# EAGLE design main (EAGLE 5.01)
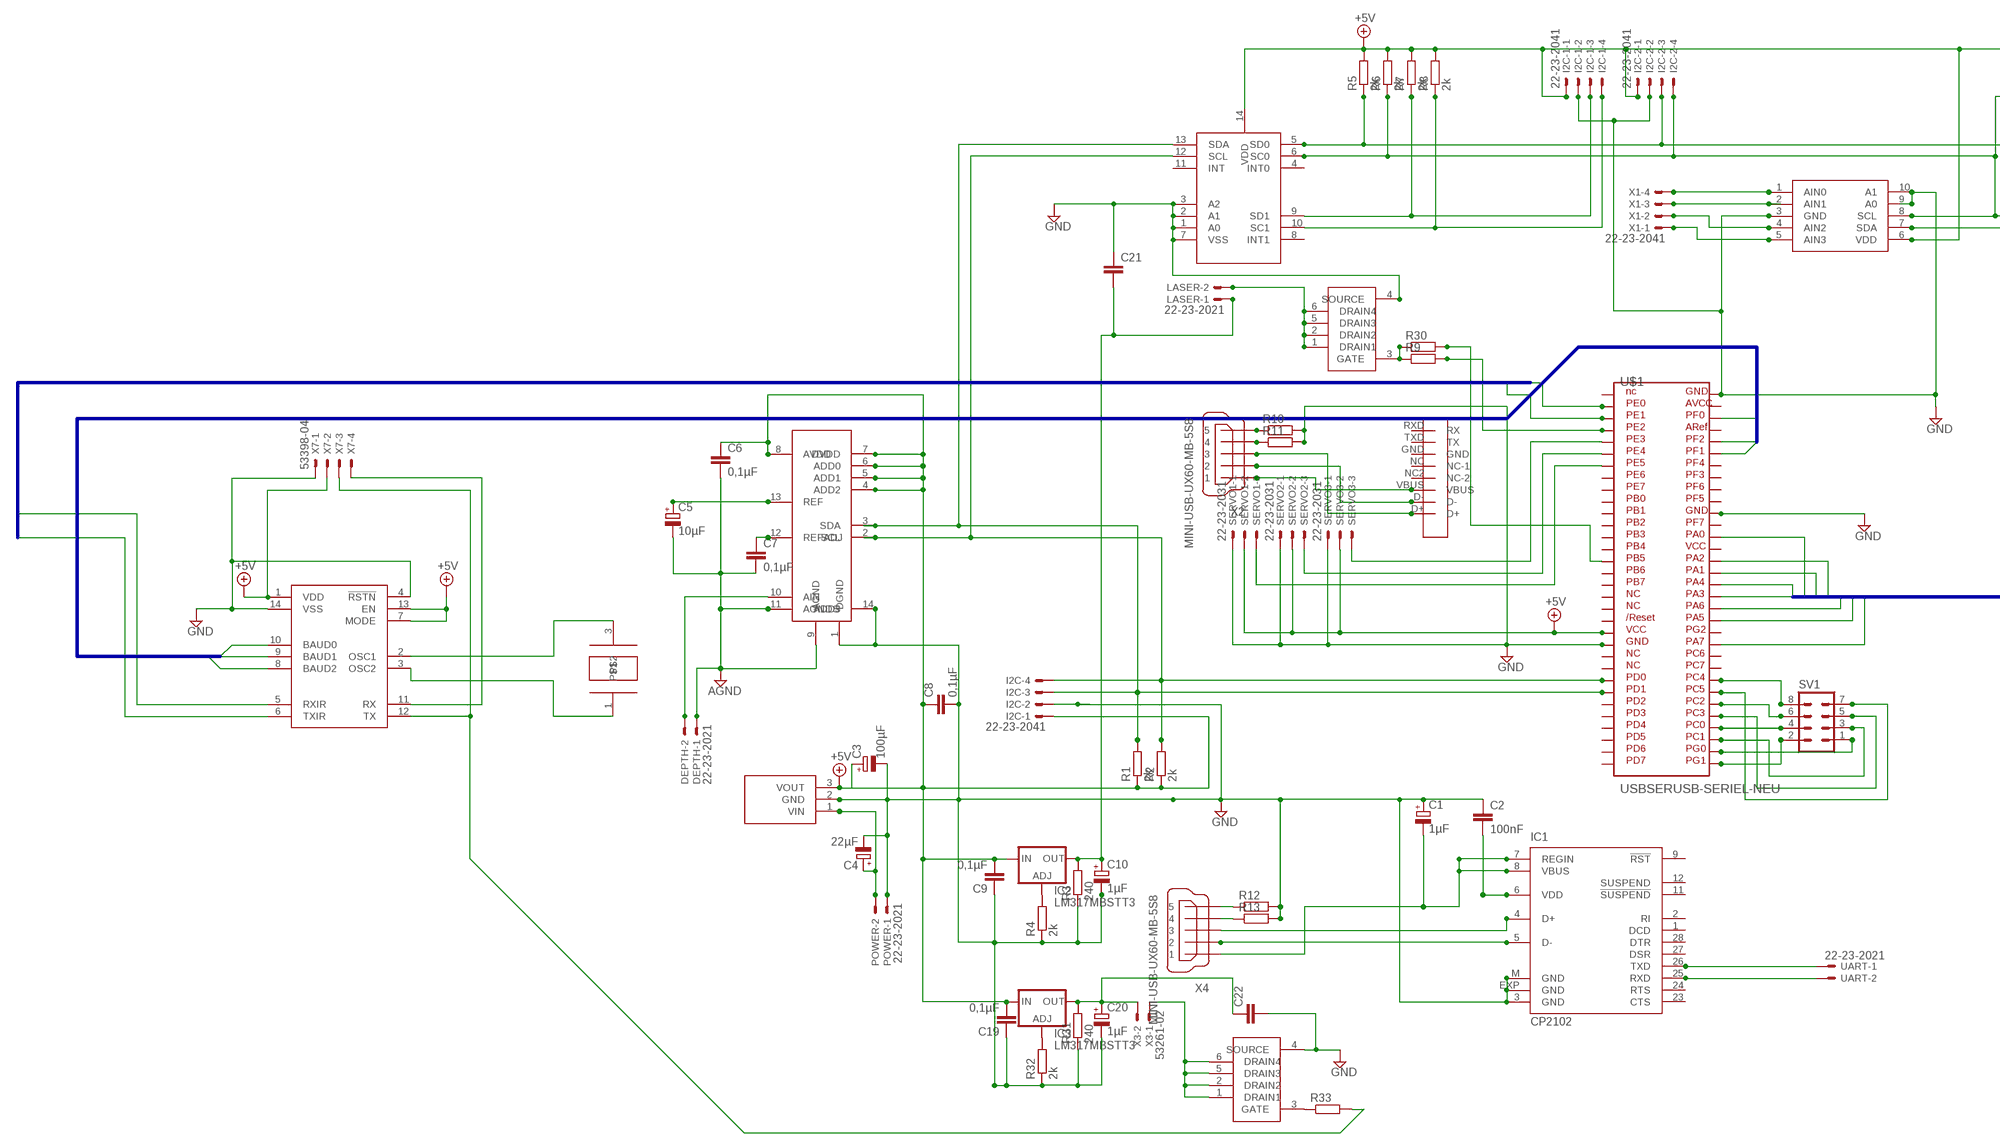
[diagram p0: schematic, sheet 1, part 1 of 2]
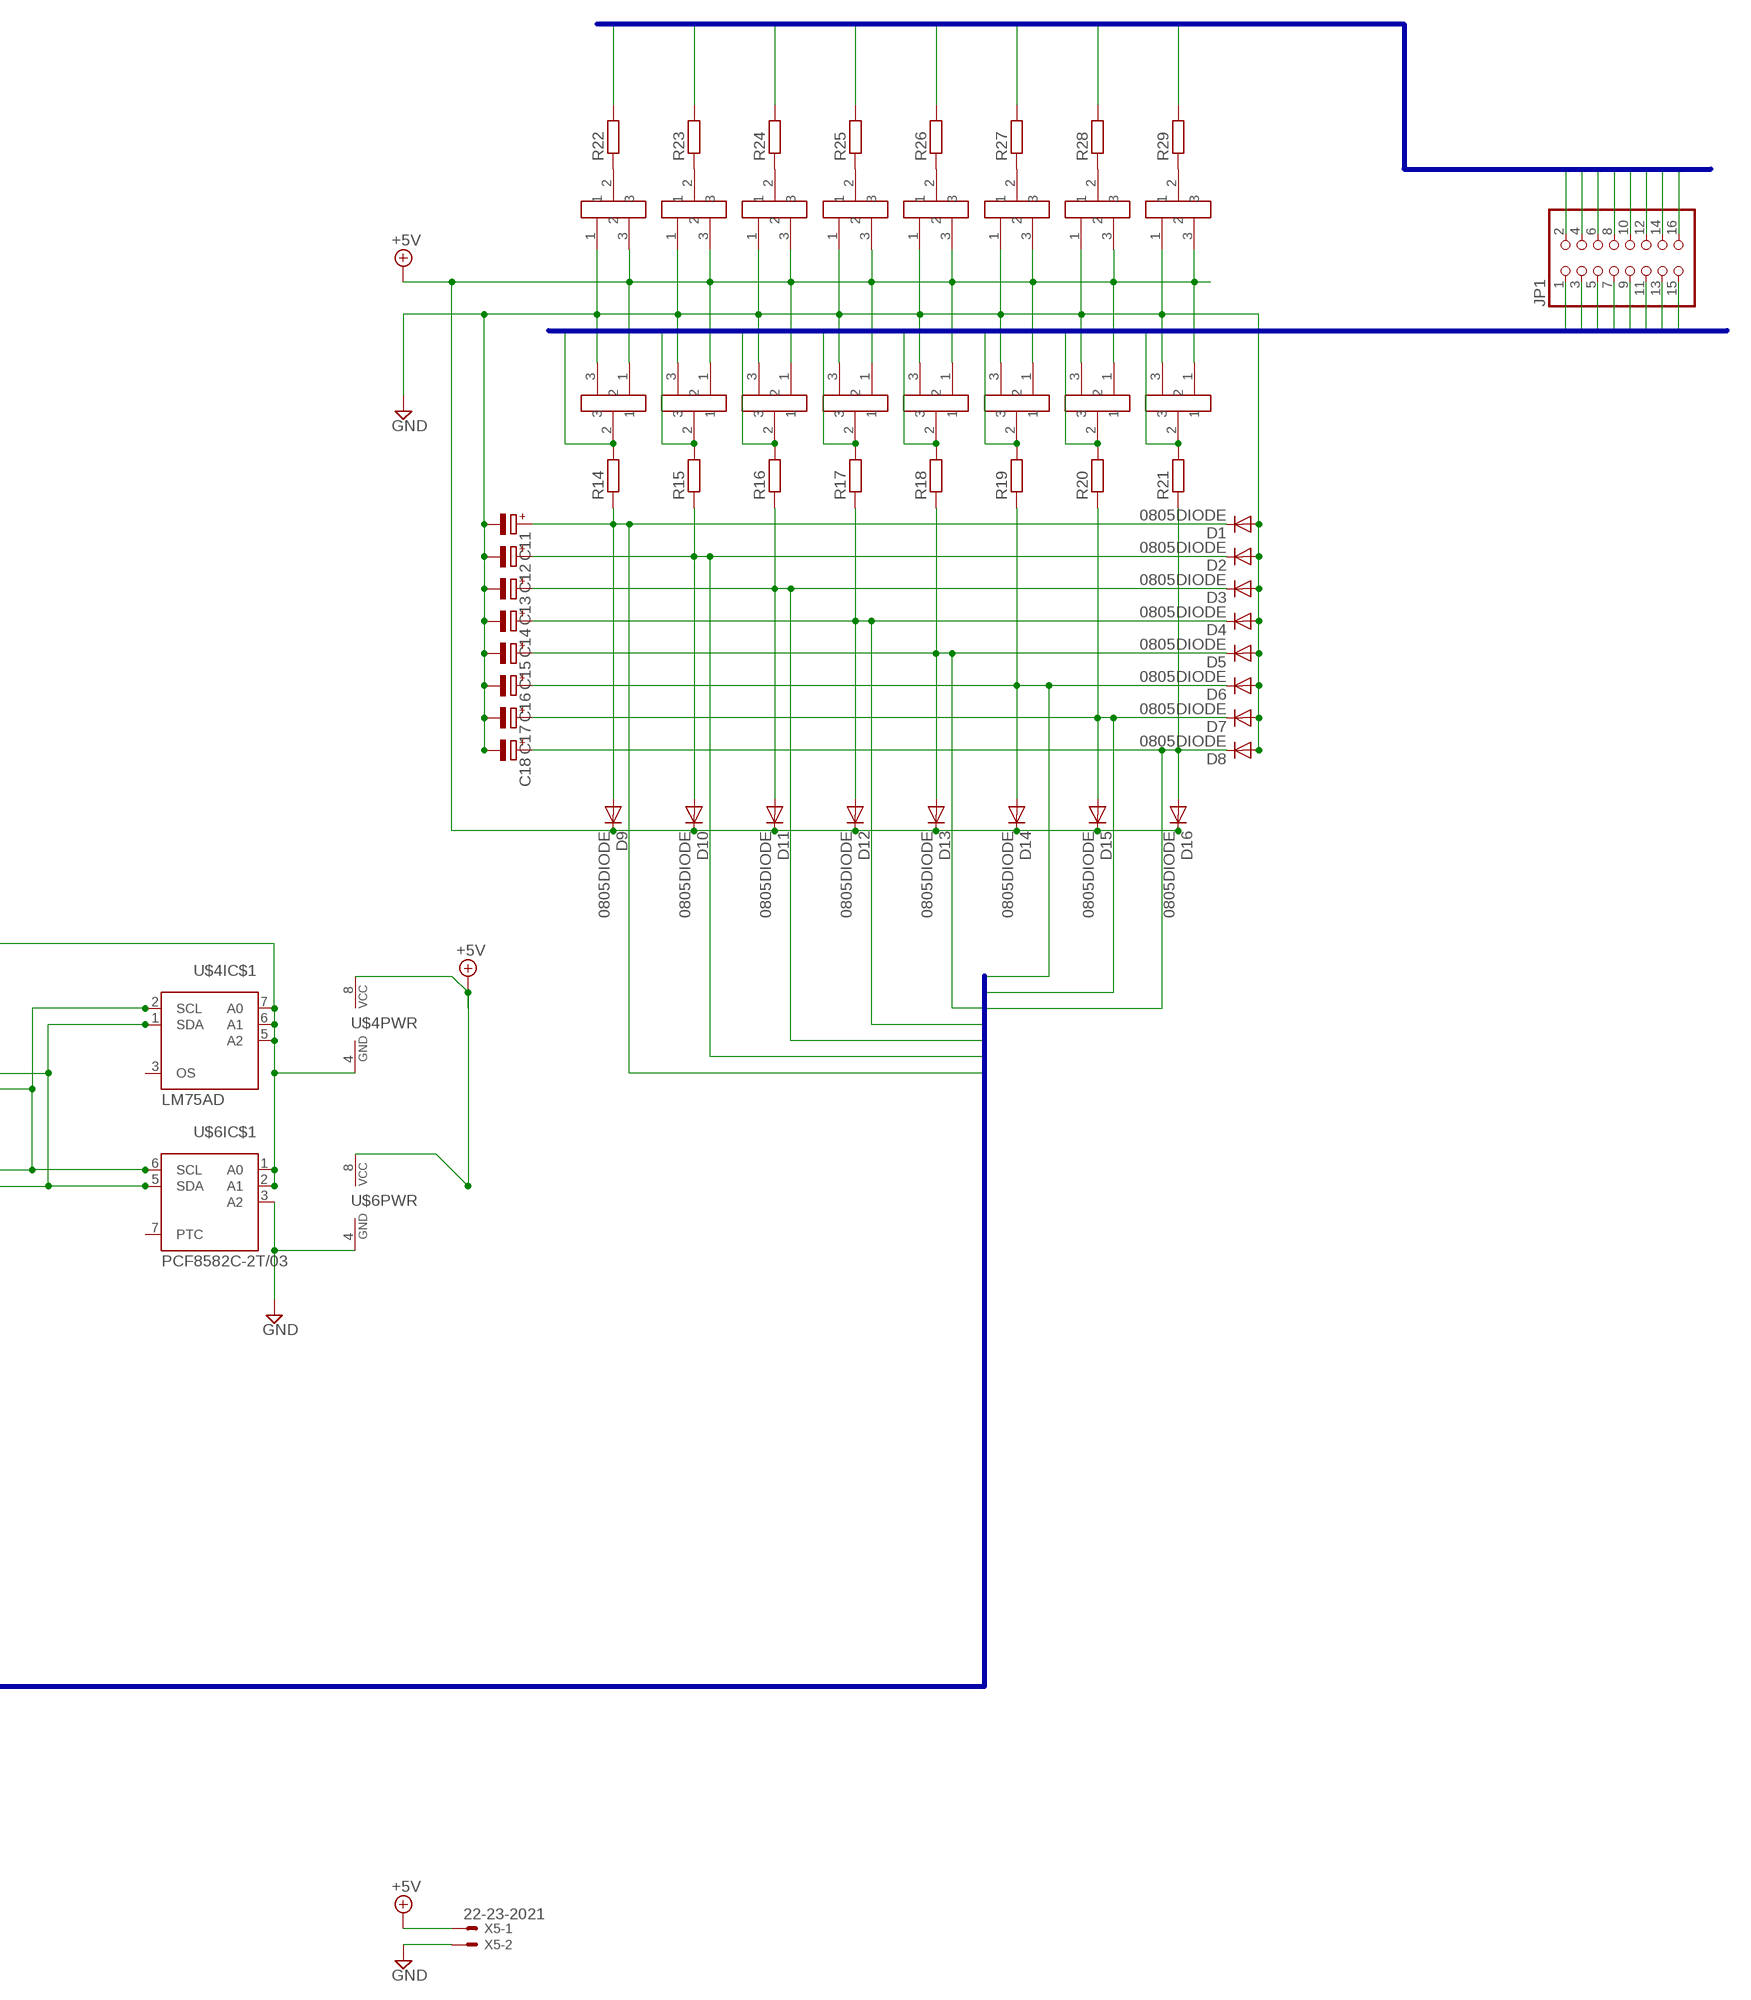
[diagram p1: schematic, sheet 1, part 2 of 2]

## Parts
C1  1µF  CPOL-EUE2.5-5  [E2,5-5]
C2  100nF  C-EUC0603  [C0603]
C3  100µF  CPOL-EUE2.5-5  [E2,5-5]
C4  22µF  CPOL-EUE2.5-5  [E2,5-5]
C5  10µF  CPOL-EUE2.5-7  [E2,5-7]
C6  0,1µF  C-EUC0603  [C0603]
C7  0,1µF  C-EUC0603  [C0603]
C8  0,1µF  C-EUC0603  [C0603]
C9  0,1µF  C-EUC0603  [C0603]
C10  1µF  CPOL-EUE2.5-5  [E2,5-5]
C11  CPOL-EUE2.5-5  [E2,5-5]
C12  CPOL-EUE2.5-5  [E2,5-5]
C13  CPOL-EUE2.5-5  [E2,5-5]
C14  CPOL-EUE2.5-5  [E2,5-5]
C15  CPOL-EUE2.5-5  [E2,5-5]
C16  CPOL-EUE2.5-5  [E2,5-5]
C17  CPOL-EUE2.5-5  [E2,5-5]
C18  CPOL-EUE2.5-5  [E2,5-5]
C19  0,1µF  C-EUC0603  [C0603]
C20  1µF  CPOL-EUE2.5-5  [E2,5-5]
C21  C-EUC1206  [C1206]
C22  C-EUC1206  [C1206]
D1  0805DIODE  [R0805]
D2  0805DIODE  [R0805]
D3  0805DIODE  [R0805]
D4  0805DIODE  [R0805]
D5  0805DIODE  [R0805]
D6  0805DIODE  [R0805]
D7  0805DIODE  [R0805]
D8  0805DIODE  [R0805]
D9  0805DIODE  [R0805]
D10  0805DIODE  [R0805]
D11  0805DIODE  [R0805]
D12  0805DIODE  [R0805]
D13  0805DIODE  [R0805]
D14  0805DIODE  [R0805]
D15  0805DIODE  [R0805]
D16  0805DIODE  [R0805]
DEPTH  22-23-2021  [22-23-2021]
I2C  22-23-2041  [22-23-2041]
I2C-1  22-23-2041  [22-23-2041]
I2C-2  22-23-2041  [22-23-2041]
IC1  CP2102  [MLP28]
IC2  LM317MBSTT3  [SOT223]
IC3  LM317MBSTT3  [SOT223]
JP1  PINHD-2X8  [2X08]
LASER  22-23-2021  [22-23-2021]
MCP2120  MCP2120  [SOIC14]
POWER  22-23-2021  [22-23-2021]
R1  2k  R-EU_R0603  [R0603]
R2  2k  R-EU_R0603  [R0603]
R3  240  R-EU_R0603  [R0603]
R4  2k  R-EU_R0603  [R0603]
R5  2k  R-EU_R0603  [R0603]
R6  2k  R-EU_R0603  [R0603]
R7  2k  R-EU_R0603  [R0603]
R8  2k  R-EU_R0603  [R0603]
R9  R-EU_R0603  [R0603]
R10  R-EU_R0603  [R0603]
R11  R-EU_R0603  [R0603]
R12  R-EU_R0603  [R0603]
R13  R-EU_R0603  [R0603]
R14  R-EU_R0603  [R0603]
R15  R-EU_R0603  [R0603]
R16  R-EU_R0603  [R0603]
R17  R-EU_R0603  [R0603]
R18  R-EU_R0603  [R0603]
R19  R-EU_R0603  [R0603]
R20  R-EU_R0603  [R0603]
R21  R-EU_R0603  [R0603]
R22  R-EU_R0603  [R0603]
R23  R-EU_R0603  [R0603]
R24  R-EU_R0603  [R0603]
R25  R-EU_R0603  [R0603]
R26  R-EU_R0603  [R0603]
R27  R-EU_R0603  [R0603]
R28  R-EU_R0603  [R0603]
R29  R-EU_R0603  [R0603]
R30  R-EU_R0603  [R0603]
R31  240  R-EU_R0603  [R0603]
R32  2k  R-EU_R0603  [R0603]
R33  R-EU_R0603  [R0603]
SERVO1  22-23-2031  [22-23-2031]
SERVO2  22-23-2031  [22-23-2031]
SERVO3  22-23-2031  [22-23-2031]
SV1  MA04-2  [MA04-2]
U$1  USBSERUSB-SERIEL-NEU  [SERIAL-USB-NEU]
U$2  R78BXX-1.0  [SIP3]
U$3  MAX1169  [TSSOP14]
U$4  LM75AD  [SO08]
U$5  PCA9542AD-T  [SOIC14]
U$6  PCF8582C-2T/03  [SO08]
U$7  ADS1112  [MSOP10]
U$8  NTGS4141N  [SSOT6]
U$9  SMD-CON-3-PIN  [SMDPAD-3X]
U$10  SMD-CON-3-PIN  [SMDPAD-3X]
U$11  SMD-CON-3-PIN  [SMDPAD-3X]
U$12  SMD-CON-3-PIN  [SMDPAD-3X]
U$13  SMD-CON-3-PIN  [SMDPAD-3X]
U$14  SMD-CON-3-PIN  [SMDPAD-3X]
U$15  SMD-CON-3-PIN  [SMDPAD-3X]
U$16  SMD-CON-3-PIN  [SMDPAD-3X]
U$17  SMD-CON-3-PIN  [SMDPAD-3X]
U$18  SMD-CON-3-PIN  [SMDPAD-3X]
U$19  SMD-CON-3-PIN  [SMDPAD-3X]
U$20  SMD-CON-3-PIN  [SMDPAD-3X]
U$21  SMD-CON-3-PIN  [SMDPAD-3X]
U$22  SMD-CON-3-PIN  [SMDPAD-3X]
U$23  SMD-CON-3-PIN  [SMDPAD-3X]
U$24  SMD-CON-3-PIN  [SMDPAD-3X]
U$25  ABMM2  [ABMM2]
U$27  NTGS4141N  [SSOT6]
UART  22-23-2021  [22-23-2021]
X1  22-23-2041  [22-23-2041]
X2  MINI-USB-UX60-MB-5S8  [UX60-MB-5S8]
X3  53261-02  [53261-02]
X4  MINI-USB-UX60-MB-5S8  [UX60-MB-5S8]
X5  22-23-2021  [22-23-2021]
X7  53398-04  [53398-04]

## Nets
+3V: C10.+ C21.2 IC2.4(OUT) LASER.1 R3.2
+5V: C3.+ C6.1 C8.1 C9.2 C19.2 D9.2(C) D10.2(C) D11.2(C) D12.2(C) D13.2(C) D14.2(C) D15.2(C) D16.2(C) I2C-1.1 I2C-2.1 I2C.1 IC2.3(IN) IC3.3(IN) MCP2120.1(VDD) MCP2120.7(MODE) MCP2120.13(EN) R1.1 R2.1 R5.2 R6.2 R7.2 R8.2 SERVO1.2 SERVO2.2 SERVO3.2 U$1.VCC2(VCC) U$2.3(VOUT) U$3.4(ADD2) U$3.5(ADD1) U$3.6(ADD0) U$3.7(DVDD) U$3.8(AVDD) U$4.4(PWR:GND) U$4.5(IC$1:A2) U$4.6(IC$1:A1) U$4.7(IC$1:A0) U$4.8(PWR:VCC) U$5.14(VDD) U$6.1(IC$1:A0) U$6.2(IC$1:A1) U$6.8(PWR:VCC) U$7.6(VDD) U$9.1 U$10.1 U$11.1 U$12.1 U$13.1 U$14.1 U$15.1 U$16.1 U$17.3 U$18.3 U$19.3 U$20.3 U$21.3 U$22.3 U$23.3 U$24.3 X5.1 X7.2
ADD0: JP1.1 R14.2 U$9.2
ADD1: JP1.3 R15.2 U$10.2
ADD2: JP1.5 R16.2 U$11.2
ADD3: JP1.7 R17.2 U$12.2
ADD4: JP1.9 R18.2 U$13.2
ADD5: JP1.11 R19.2 U$14.2
ADD6: JP1.13 R20.2 U$15.2
ADD7: JP1.15 R21.2 U$16.2
ADG0: JP1.2 R22.2
ADG1: JP1.4 R23.2
ADG2: JP1.6 R24.2
ADG3: JP1.8 R25.2
ADG4: JP1.10 R26.2
ADG5: JP1.12 R27.2
ADG6: JP1.14 R28.2
ADG7: JP1.16 R29.2
AGND: C5.- C6.2 C7.2 DEPTH.1 U$3.9(AGND) U$3.11(AGNDS)
GND: C1.+ C2.1 C3.- C4.- C8.2 C9.1 C10.- C11.- C12.- C13.- C14.- C15.- C16.- C17.- C18.- C19.1 C20.- C21.1 C22.2 D1.1(A) D2.1(A) D3.1(A) D4.1(A) D5.1(A) D6.1(A) D7.1(A) D8.1(A) I2C-1.2 I2C-2.2 I2C.2 IC1.3(GND) IC1.EXP(GND) IC1.M(GND) MCP2120.4(!RSTN) MCP2120.14(VSS) POWER.1 R3.1 R4.1 R10.2 R11.2 R12.2 R13.2 R31.1 R32.1 SERVO1.1 SERVO2.1 SERVO3.1 U$1.GND2(GND) U$1.GND3(GND) U$1.GND4(GND) U$2.2(GND) U$3.1(DGND) U$3.14(ADD3) U$5.1(A0) U$5.2(A1) U$5.3(A2) U$5.7(VSS) U$6.3(IC$1:A2) U$6.4(PWR:GND) U$7.3(GND) U$7.9(A0) U$7.10(A1) U$8.4(SOURCE) U$9.3 U$10.3 U$11.3 U$12.3 U$13.3 U$14.3 U$15.3 U$16.3 U$17.1 U$18.1 U$19.1 U$20.1 U$21.1 U$22.1 U$23.1 U$24.1 U$27.4(SOURCE) X5.2 X7.1
N$1: IC1.26(TXD) UART.1
N$2: IC1.25(RXD) UART.2
N$3: R13.1 X4.4
N$4: IC1.5(D-) X4.2
N$5: C1.- IC1.7(REGIN) IC1.8(VBUS) X4.1
N$6: C2.2 IC1.6(VDD)
N$7: I2C.4 R2.2 U$1.PD0 U$3.2(SCL) U$5.12(SCL)
N$8: C5.+ U$3.13(REF)
N$9: C7.1 U$3.12(REFADJ)
N$10: R9.1 R30.1 U$8.3(GATE)
N$11: DEPTH.2 U$3.10(AIN)
N$12: I2C.3 R1.2 U$1.PD1 U$3.3(SDA) U$5.13(SDA)
N$15: IC2.1(ADJ) R4.2
N$16: R30.2 U$1.PB5
N$17: SV1.1 U$1.PG0
N$18: I2C-2.3 R5.1 U$4.1(IC$1:SDA) U$5.5(SD0) U$6.5(IC$1:SDA) U$7.7(SDA)
N$19: I2C-2.4 R6.1 U$4.2(IC$1:SCL) U$5.6(SC0) U$6.6(IC$1:SCL) U$7.8(SCL)
N$20: R12.1 X4.5
N$21: I2C-1.3 R7.1 U$5.9(SD1)
N$22: I2C-1.4 R8.1 U$5.10(SC1)
N$23: C4.+ POWER.2 U$2.1(VIN)
N$24: U$7.1(AIN0) X1.4
N$25: U$7.2(AIN1) X1.3
N$26: U$7.4(AIN2) X1.2
N$27: U$7.5(AIN3) X1.1
N$28: R9.2 U$1.PE2
N$29: U$1.D- X2.2
N$30: LASER.2 U$8.1(DRAIN1) U$8.2(DRAIN2) U$8.5(DRAIN3) U$8.6(DRAIN4)
N$31: U$1.D+ X2.3
N$32: U$1.VBUS X2.1
N$33: IC1.4(D+) X4.3
N$34: SERVO3.3 U$1.PE3
N$35: R10.1 X2.5
N$36: R11.1 X2.4
N$37: SERVO2.3 U$1.PE4
N$38: SERVO1.3 U$1.PE5
N$39: SV1.2 U$1.PG1
N$40: SV1.3 U$1.PC1
N$41: SV1.4 U$1.PC0
N$42: SV1.5 U$1.PC3
N$43: SV1.6 U$1.PC2
N$44: R22.1 U$17.2
N$45: R23.1 U$18.2
N$46: R24.1 U$19.2
N$47: R25.1 U$20.2
N$48: R26.1 U$21.2
N$49: R27.1 U$22.2
N$50: R28.1 U$23.2
N$51: R29.1 U$24.2
N$52: SV1.7 U$1.PC5
N$53: SV1.8 U$1.PC4
N$54: R33.1 U$27.3(GATE)
N$55: C20.+ C22.1 IC3.4(OUT) R31.2 X3.2
N$56: IC3.1(ADJ) R32.2
N$57: U$27.1(DRAIN1) U$27.2(DRAIN2) U$27.5(DRAIN3) U$27.6(DRAIN4) X3.1
N$61: MCP2120.3(OSC2) U$25.1
N$62: MCP2120.2(OSC1) U$25.3
PA0: C11.+ D1.2(C) D9.1(A) R14.1 U$1.PA0
PA1: C12.+ D2.2(C) D10.1(A) R15.1 U$1.PA1
PA2: C13.+ D3.2(C) D11.1(A) R16.1 U$1.PA2
PA3: C14.+ D4.2(C) D12.1(A) R17.1 U$1.PA3
PA4: C15.+ D5.2(C) D13.1(A) R18.1 U$1.PA4
PA5: C16.+ D6.2(C) D14.1(A) R19.1 U$1.PA5
PA6: C17.+ D7.2(C) D15.1(A) R20.1 U$1.PA6
PA7: C18.+ D8.2(C) D16.1(A) R21.1 U$1.PA7
PF0: MCP2120.10(BAUD0) U$1.PF0
PF1: MCP2120.9(BAUD1) U$1.PF1
PF2: MCP2120.8(BAUD2) U$1.PF2
RXIR: MCP2120.11(RX) X7.4
TXIR: MCP2120.12(TX) R33.2 X7.3
UART0: MCP2120.5(RXIR) U$1.PE0
UART1: MCP2120.6(TXIR) U$1.PE1
Unconnected: IC1.1(DCD) IC1.2(RI) IC1.9(!RST) IC1.11(!SUSPEND) IC1.12(SUSPEND) IC1.23(CTS) IC1.24(RTS) IC1.27(DSR) IC1.28(DTR) U$1.AREF U$1.AVCC U$1.CANH(NC) U$1.CANL(NC) U$1.GND U$1.NC2(NC-2) U$1.NC3(NC) U$1.NC4(NC) U$1.NC(NC-1) U$1.PB0 U$1.PB1 U$1.PB2 U$1.PB3 U$1.PB4 U$1.PB6 U$1.PB7 U$1.PC6 U$1.PC7 U$1.PD2 U$1.PD3 U$1.PD4 U$1.PD5 U$1.PD6 U$1.PD7 U$1.PE6 U$1.PE7 U$1.PF3 U$1.PF4 U$1.PF5 U$1.PF6 U$1.PF7 U$1.PG2 U$1.RESET(NC) U$1.RS(/RESET) U$1.RXD(RX) U$1.TXD(TX) U$1.VCC U$4.3(IC$1:OS) U$5.4(INT0) U$5.8(INT1) U$5.11(INT) U$6.7(IC$1:PTC)

## Buses
PA[0..7]
ADD[0..7]
ADG[0..7]
UART[0..1]
PF[0..2]

## Library data of the parts
C1 C3-C5 C10-C18 C20 = rcl:CPOL-EU: POLARIZED CAPACITOR, European symbol
C2 C6-C9 C19 C21 C22 = rcl:C-EU: CAPACITOR, European symbol
D1-D16 = matthias:0805DIODE
DEPTH LASER POWER UART X5 = con-molex:22-23-2021: .100" (2.54mm) Center Header - 2 Pin
I2C I2C-1 I2C-2 X1 = con-molex:22-23-2041: .100" (2.54mm) Center Header - 4 Pin
IC1 = silabs:CP210*: Single-Chip USB to UART Bridge Source: www.silabs.com .. CP2101.pdf / cp2102.pdf
IC2 IC3 = v-reg:LM317?*: 500 mA Adjustable Output Positive Voltage Regulator Source: http://www.onsemi.co.jp .. LM317M-D.PDF
JP1 = pinhead:PINHD-2X8: PIN HEADER
MCP2120 = matthias:MCP2120
R1-R33 = rcl:R-EU_: RESISTOR, European symbol
SERVO1-SERVO3 = con-molex:22-23-2031: .100" (2.54mm) Center Header - 3 Pin
SV1 = con-lstb:MA04-2: PIN HEADER
U$1 = crumb128symbol:USBSER
U$2 = matthias:R78BXX-1.0
U$3 = maxim:MAX1169
U$4 = i2c:LM75AD: Digital Temperature Sensor and Thermal Watchdog
U$5 = matthias:PCA9542AD-T
U$6 = i2c:PCF8582C-2: 256 x 8-Bit CMOS EEPROM with I²C Bus Interface
U$7 = matthias:ADS1112
U$8 U$27 = matthias:NTGS4141N
U$9-U$24 = matthias:SMD-CON-3-PIN
U$25 = matthias:ABMM2
X2 X4 = con-hirose:MINI-USB-: MINI USB Connector Source: http://www.hirose.co.jp/cataloge_hp/e24000019.pdf
X3 = con-molex:53?-02: CONNECTOR wire to board 1.25 mm (.049 inch) pitch header
X7 = con-molex:53?-04: CONNECTOR wire to board 1.25 mm (.049 inch) pitch header

## Board
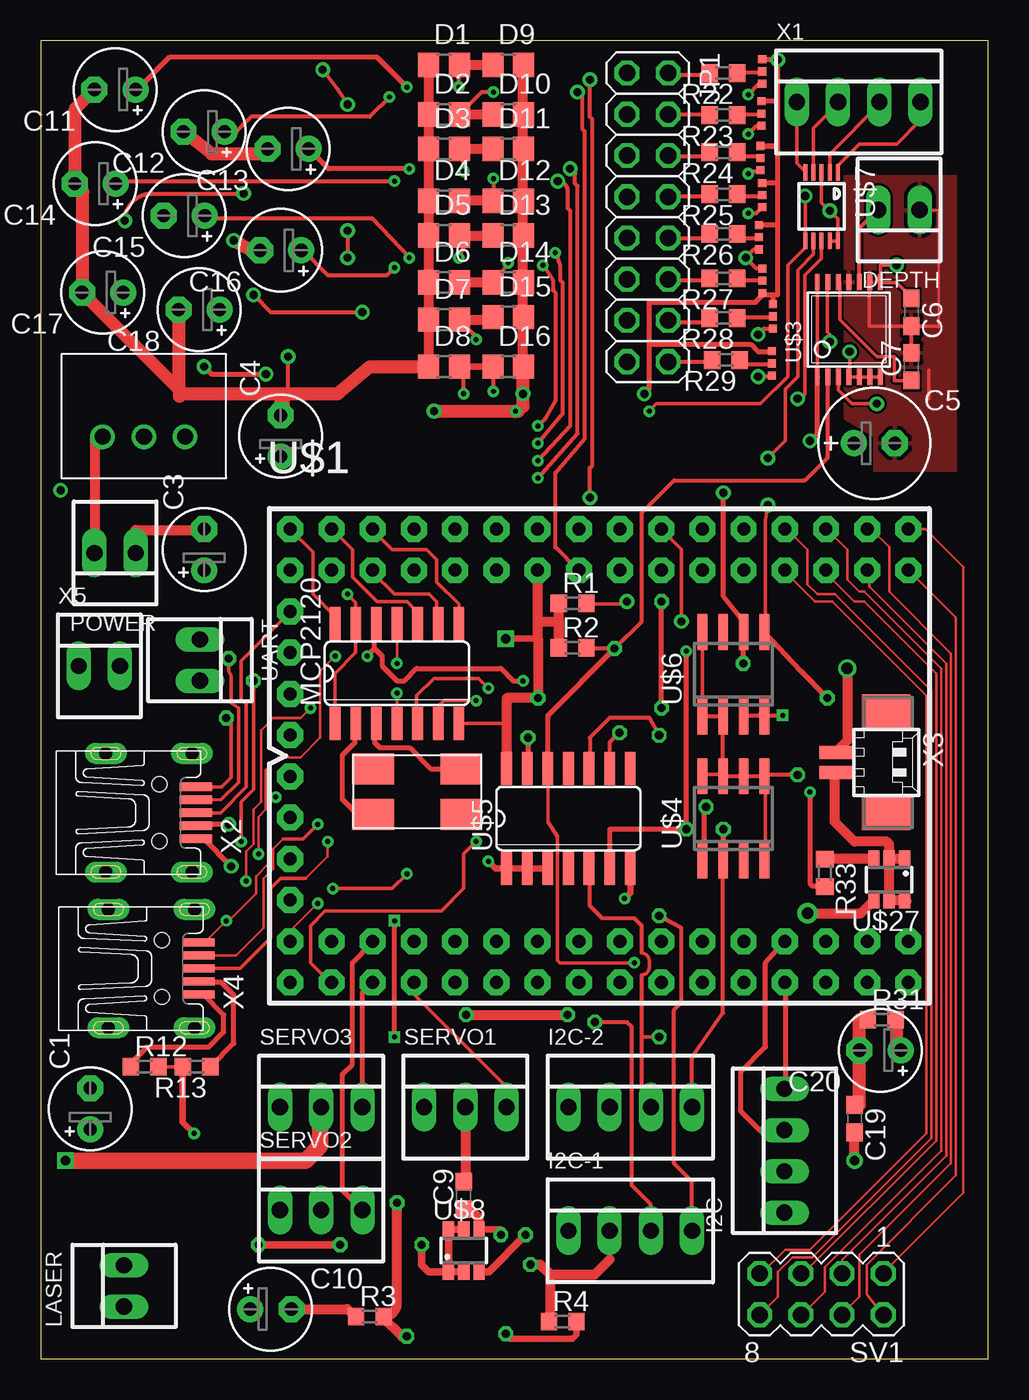
[diagram p2: board, top side]
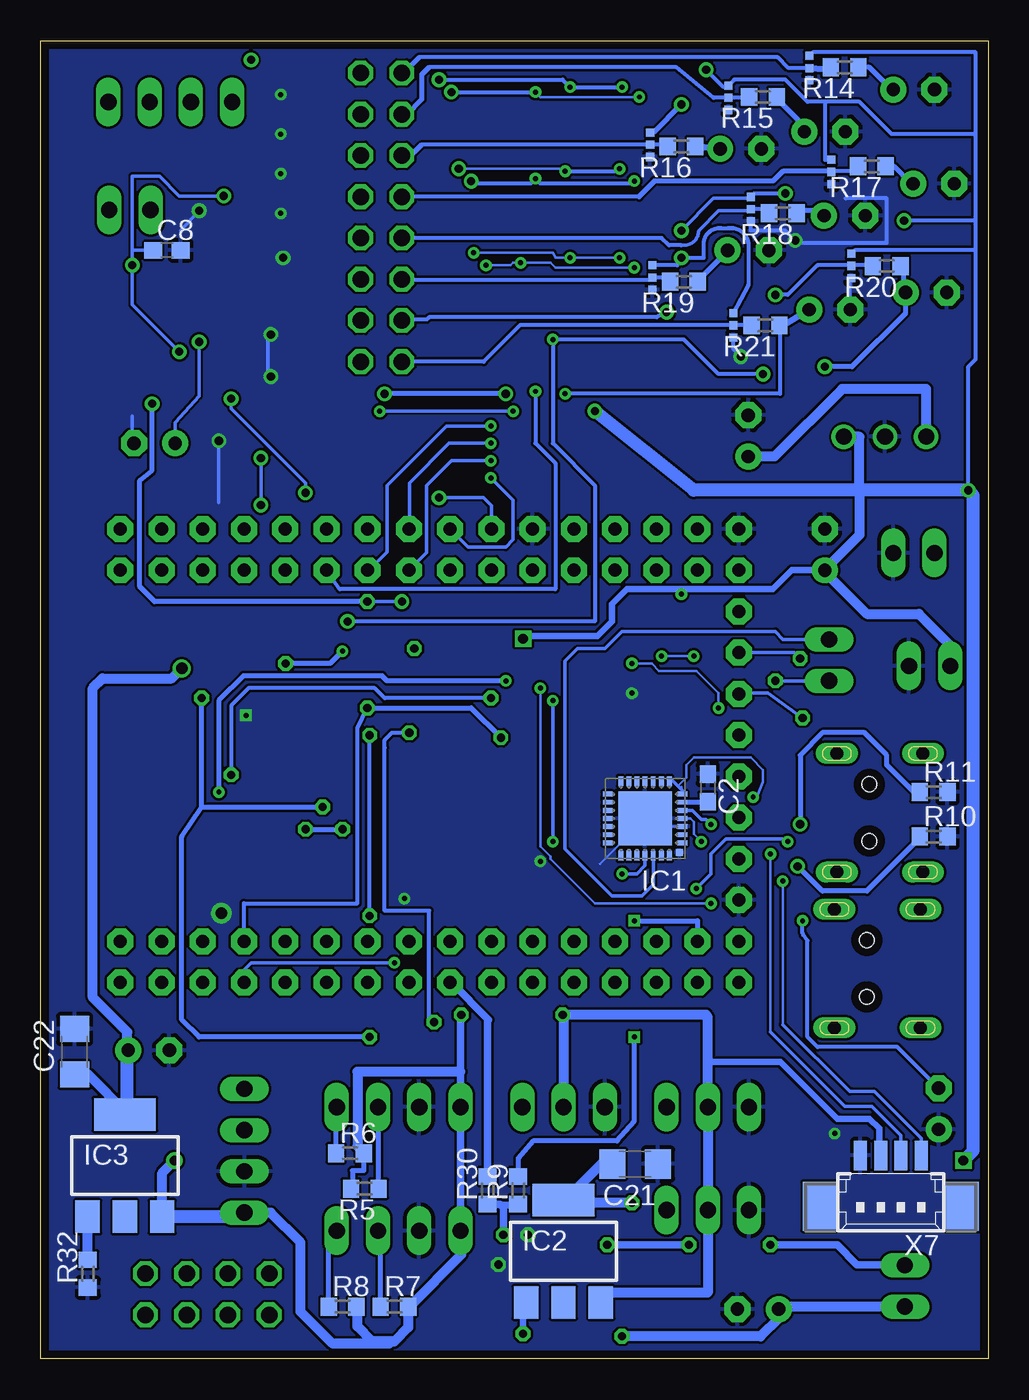
[diagram p3: board, bottom side, seen from below]

Size 58.39 x 81.22 mm. Coordinates in mm from the lower left corner, seen from the top.
Outline: 0,0 58.39,0 58.39,81.22 0,81.22 0,0
Copper layers (1*16): Top 0.035mm / dielectric 1.5mm / Bottom 0.035mm
Design rules "default *": minimum track width 6mil, minimum drill 12mil, track to track 6mil, track to pad 6mil, pad to pad 6mil, via to via 6mil, smd to smd 6mil, copper to edge 20mil, drill to drill 6mil, minimum pad ring 10mil, minimum via ring 8mil, stop-mask expansion 4mil, vias tented up to drill 20mil, thermal gap 10mil

### Footprints (pad centres in the part's own frame; a part is rotated, then mirrored left to right if it is on the bottom)
E2,5-5 = drill 0.813 pad 1.6 round: + -1.27,0 | drill 0.813 pad 1.6 octagon: - 1.27,0
C0603 = smd 1.1 x 1: 1 -0.85,0; 2 0.85,0
E2,5-7 = drill 0.813 pad 1.6 round: + -1.27,0 | drill 0.813 pad 1.6 octagon: - 1.27,0
C1206 = smd 1.6 x 1.8: 1 -1.4,0; 2 1.4,0
R0805 = smd 1.3 x 1.5: 1 -0.95,0; 2 0.95,0
22-23-2021 = drill 1 long: 1 -1.27,0; 2 1.27,0
22-23-2041 = drill 1 long: 1 -3.81,0; 2 -1.27,0; 3 1.27,0; 4 3.81,0
MLP28 = smd 0.6 x 0.3: 1 -2.3,1.5; 2 -2.3,1; 3 -2.3,0.5; 4 -2.3,0; 5 -2.3,-0.5; 6 -2.3,-1; 7 -2.3,-1.5; 15 2.3,-1.5; 16 2.3,-1; 17 2.3,-0.5; 18 2.3,0; 19 2.3,0.5; 20 2.3,1; 21 2.3,1.5 | smd 0.3 x 0.6: 8 -1.5,-2.3; 9 -1,-2.3; 10 -0.5,-2.3; 11 0,-2.3; 12 0.5,-2.3; 13 1,-2.3; 14 1.5,-2.3; 22 1.5,2.3; 23 1,2.3; 24 0.5,2.3; 25 0,2.3; 26 -0.5,2.3; 27 -1,2.3; 28 -1.5,2.3 | smd 3.3 x 3.3: EXP 0,0 | smd 0.435 x 0.435: M -2.103,2.103
SOT223 = smd 1.5 x 2: 1 -2.3,-3.15; 2 0,-3.15; 3 2.3,-3.15 | smd 3.8 x 2: 4 0,3.15
2X08 = drill 1.016 octagon: 1 -8.89,-1.27; 2 -8.89,1.27; 3 -6.35,-1.27; 4 -6.35,1.27; 5 -3.81,-1.27; 6 -3.81,1.27; 7 -1.27,-1.27; 8 -1.27,1.27; 9 1.27,-1.27; 10 1.27,1.27; 11 3.81,-1.27; 12 3.81,1.27; 13 6.35,-1.27; 14 6.35,1.27; 15 8.89,-1.27; 16 8.89,1.27
SOIC14 = smd 0.66 x 2.032: 1 -3.81,-3.073; 2 -2.54,-3.073; 3 -1.27,-3.073; 4 0,-3.073; 5 1.27,-3.073; 6 2.54,-3.073; 7 3.81,-3.073; 8 3.81,3.073; 9 2.54,3.073; 10 1.27,3.073; 11 0,3.073; 12 -1.27,3.073; 13 -2.54,3.073; 14 -3.81,3.073
R0603 = smd 1 x 1.1: 1 -0.85,0; 2 0.85,0
22-23-2031 = drill 1 long: 1 -2.54,0; 2 0,0; 3 2.54,0
MA04-2 = drill 1.016 octagon: 1 -3.81,-1.27; 2 -3.81,1.27; 3 -1.27,-1.27; 4 -1.27,1.27; 5 1.27,-1.27; 6 1.27,1.27; 7 3.81,-1.27; 8 3.81,1.27
SERIAL-USB-NEU = drill 0.8 pad 1.6 octagon: AREF -17.145,11.43; AVCC -19.685,11.43; CANH 0.635,-11.43; CANL 3.175,-13.97; D+ -19.685,8.89; D- -19.685,6.35; GND 5.715,-11.43; GND2 -6.985,13.97; GND3 -19.685,13.97; GND4 -19.685,-8.89; NC -19.685,-13.97; NC2 8.255,-13.97; NC3 -19.685,1.27; NC4 -19.685,-6.35; PA0 -4.445,13.97; PA1 -1.905,11.43; PA2 -1.905,13.97; PA3 0.635,11.43; PA4 0.635,13.97; PA5 3.175,11.43; PA6 3.175,13.97; PA7 5.715,11.43; PB0 -9.525,-11.43; PB1 -6.985,-13.97; PB2 -6.985,-11.43; PB3 -4.445,-13.97; PB4 -4.445,-11.43; PB5 -1.905,-13.97; PB6 -1.905,-11.43; PB7 0.635,-13.97; PC0 15.875,13.97; PC1 15.875,11.43; PC2 13.335,13.97; PC3 13.335,11.43; PC4 10.795,13.97; PC5 10.795,11.43; PC6 8.255,13.97; PC7 8.255,11.43; PD0 10.795,-13.97; PD1 10.795,-11.43; PD2 13.335,-13.97; PD3 13.335,-11.43; PD4 15.875,-13.97; PD5 15.875,-11.43; PD6 18.415,-13.97; PD7 18.415,-11.43; PE0 -19.685,-11.43; PE1 -17.145,-13.97; PE2 -17.145,-11.43; PE3 -14.605,-13.97; PE4 -14.605,-11.43; PE5 -12.065,-13.97; PE6 -12.065,-11.43; PE7 -9.525,-13.97; PF0 -17.145,13.97; PF1 -14.605,11.43; PF2 -14.605,13.97; PF3 -12.065,11.43; PF4 -12.065,13.97; PF5 -9.525,11.43; PF6 -9.525,13.97; PF7 -6.985,11.43; PG0 18.415,13.97; PG1 18.415,11.43; PG2 5.715,13.97; RESET 3.175,-11.43; RS 8.255,-11.43; RXD -19.685,-1.27; TXD -19.685,-3.81; VBUS -19.685,3.81; VCC 5.715,-13.97; VCC2 -4.445,11.43
SIP3 = drill 1 round: 1 -2.54,0; 2 0,0; 3 2.54,0
TSSOP14 = smd 0.305 x 0.991: 1 -1.95,-2.918; 2 -1.3,-2.918; 3 -0.65,-2.918; 4 0,-2.918; 5 0.65,-2.918; 6 1.3,-2.918; 7 1.95,-2.918; 8 1.95,2.918; 9 1.3,2.918; 10 0.65,2.918; 11 0,2.918; 12 -0.65,2.918; 13 -1.3,2.918; 14 -1.95,2.918
SO08 = smd 0.6 x 2.2: 1 -1.905,-2.6; 2 -0.635,-2.6; 3 0.635,-2.6; 4 1.905,-2.6; 5 1.905,2.6; 6 0.635,2.6; 7 -0.635,2.6; 8 -1.905,2.6
MSOP10 = smd 0.25 x 1: 1 -1,-2.113; 2 -0.5,-2.113; 3 0,-2.113; 4 0.5,-2.113; 5 1,-2.113; 6 1,2.113; 7 0.5,2.113; 8 0,2.113; 9 -0.5,2.113; 10 -1,2.113
SSOT6 = smd 0.69 x 0.99: 1 -0.95,-1.3; 2 0,-1.3; 3 0.95,-1.3; 4 0.95,1.3; 5 0,1.3; 6 -0.95,1.3
SMDPAD-3X = smd 0.5 x 0.5: 1 -0.25,0.5; 2 -0.25,-0.25; 3 -0.25,-1
ABMM2 = smd 2.575 x 1.9: 1 0,-2.8; 2 5.425,-2.8; 3 5.425,0; 4 0,0
UX60-MB-5S8 = smd 2 x 0.5: 1 8.65,1.6; 2 8.65,0.8; 3 8.65,0; 4 8.65,-0.8; 5 8.65,-1.6 | drill 0.8 long: M1 3.1,-3.65; M2 3.1,3.65; M3 8.4,3.65; M4 8.4,-3.65 | hole 0.9: 6.4,-1.75; 6.4,1.75
53261-02 = smd 0.8 x 2: 1 0.625,-2.5; 2 -0.625,-2.5 | smd 2.1 x 3: S1 3.125,0.625; S2 -3.125,0.625
53398-04 = smd 0.8 x 1.8: 1 1.875,-2.5; 2 0.625,-2.5; 3 -0.625,-2.5; 4 -1.875,-2.5 | smd 2.1 x 3: S1 4.375,0.625; S2 -4.375,0.625

### Placement (x,y rotation side)
C1  3.06,15.41 90 top
C2  17.28,35.17 270 bottom
C3  10.07,49.86 90 top
C4  14.8,56.87 90 top
C5  51.37,56.41 0 top
C6  53.66,64.49 270 top
C7  53.66,61.13 90 top
C8  50.61,68.3 0 bottom
C9  26.07,10.08 90 top
C10  14.19,3.07 0 top
C11  4.58,78.2 180 top
C12  10.07,75.61 180 top
C13  15.25,74.54 180 top
C14  3.37,72.41 180 top
C15  8.85,70.43 180 top
C16  14.8,68.3 180 top
C17  3.82,65.7 180 top
C18  9.77,64.64 180 top
C19  50.15,14.8 270 top
C20  51.73,19.02 180 top
C21  21.76,12.01 180 bottom
C22  56.3,18.92 90 bottom
D1  24.85,79.73 0 top
D2  24.85,76.68 0 top
D3  24.85,74.54 0 top
D4  24.85,71.34 0 top
D5  24.85,69.21 0 top
D6  24.85,66.31 0 top
D7  24.85,64.03 0 top
D8  24.85,61.13 0 top
D9  28.82,79.73 0 top
D10  28.82,76.68 0 top
D11  28.82,74.54 0 top
D12  28.82,71.34 0 top
D13  28.82,69.21 0 top
D14  28.82,66.31 0 top
D15  28.82,64.18 0 top
D16  28.82,61.13 0 top
DEPTH  52.9,70.78 180 top
I2C  45.83,12.82 90 top
I2C-1  36.33,7.89 0 top
I2C-2  36.33,15.51 0 top
IC1  21.15,33.29 180 bottom
IC2  26.17,6.62 0 bottom
IC3  53.2,11.91 0 bottom
JP1  37.4,70.33 270 top
LASER  5.14,4.49 90 top
MCP2120  21.96,42.24 0 top
POWER  4.58,49.65 180 top
R1  32.78,46.55 0 top
R2  32.78,43.81 0 top
R3  20.28,2.61 0 top
R4  32.17,2.31 0 top
R5  38.42,10.49 180 bottom
R6  39.33,12.67 0 bottom
R7  36.59,3.22 0 bottom
R8  39.79,3.22 0 bottom
R9  28.97,10.38 90 bottom
R10  3.37,32.18 0 bottom
R11  3.37,34.92 0 bottom
R12  6.41,18 0 top
R13  9.61,18 180 top
R14  8.85,79.57 180 bottom
R15  13.88,77.74 180 bottom
R16  18.91,74.7 180 bottom
R17  7.18,73.48 180 bottom
R18  12.66,70.58 180 bottom
R19  18.76,66.37 180 bottom
R20  6.26,67.33 180 bottom
R21  13.73,63.67 180 bottom
R22  42.08,79.22 180 top
R23  42.08,76.63 180 top
R24  42.08,74.34 180 top
R25  42.08,71.75 180 top
R26  42.08,69.31 180 top
R27  42.08,66.57 180 top
R28  42.08,64.13 180 top
R29  42.23,61.54 180 top
R30  30.85,10.38 90 bottom
R31  51.83,20.9 0 top
R32  55.49,5.25 90 bottom
R33  48.32,29.94 270 top
SERVO1  26.17,15.51 0 top
SERVO2  17.28,9.16 0 top
SERVO3  17.28,15.51 0 top
SV1  48.12,3.98 180 top
U$1  35.06,37.16 0 top
U$2  6.36,56.81 0 top
U$3  49.8,63.42 0 top
U$4  42.68,33.29 0 top
U$5  32.52,33.29 0 top
U$6  42.68,42.18 0 top
U$7  48.12,70.99 180 top
U$8  26.07,6.68 0 top
U$9  10.78,79.78 0 bottom
U$10  15.76,77.95 0 bottom
U$11  20.59,75.05 0 bottom
U$12  9.41,73.38 0 bottom
U$13  14.39,71.09 0 bottom
U$14  20.43,66.87 0 bottom
U$15  8.19,67.58 0 bottom
U$16  15.46,63.93 0 bottom
U$17  44.21,79.07 180 top
U$18  44.16,76.47 180 top
U$19  44.11,73.73 180 top
U$20  44.21,71.45 180 top
U$21  44.01,68.85 180 top
U$22  44.72,66.67 0 top
U$23  44.87,63.98 180 top
U$24  44.82,61.08 180 top
U$25  25.92,33.55 180 top
U$27  52.29,29.54 180 top
UART  9.82,43.05 270 top
X1  50.41,77.44 0 top
X2  0.93,33.65 0 top
X3  51.47,36.75 270 top
X4  1.08,24.05 0 top
X5  3.62,42.69 0 top
X7  6.01,10.03 180 bottom

### Tracks (layer width: path | path; a pad name or v marks a point on that pad's centre or on a via)
+3V  (via drill 0.5)
  Top 0.61: v22.57,1.39 22.26,1.39 21.04,2.61 R3.2 arc90 21.96,3.44 v21.96,9.62
  Bottom 0.61: 12.92,2.97 12.97,2.92 | 12.92,2.97 C10.+ 12.92,2.51 14.03,1.39 v22.57,1.39 | LASER.1 12.66,3.22 12.92,2.97 | v21.96,9.62 26.07,9.62 26.07,9.67 arc-90 IC2.4 26.07,9.77 23.84,12.01 C21.2
+5V  (via drill 0.3, 0.5, 0.6)
  Top 0.152: 45.43,69.82 45.39,69.85
  Top 0.203: U$3.7 U$3.6 50.46,60.5 | R1.1 31.93,46.35 31.86,46.35 | v52.74,67.38 51.75,67.38 U$3.8 51.75,66.31 52.74,66.31 53.66,65.4 C6.1 | 50.46,60.5 U$3.5 49.85,60.5 | 50.46,60.5 50.46,60.52 | 49.85,60.5 U$3.4 | v49.85,62.05 49.85,60.5 | v47.1,71.65 47.12,71.63 U$7.6 47.12,68.46 46.04,67.38 46.04,60.52 44.36,58.85 37.96,58.85 v37.5,58.39 | 45.28,65.55 45.12,65.4 | 45.43,72.41 45.39,72.45 | U$6.1 40.76,39.58 40.7,39.64 40.78,39.72 U$6.8 | 40.76,35.89 40.7,35.83 | 40.76,35.89 U$4.8 | 42.05,36.01 40.88,36.01 40.76,35.89 | U$4.4 44.62,30.69 44.67,30.65 44.67,35.83 | 29.73,58.69 v29.73,59.46 | 45.43,77.44 45.39,77.47 | MCP2120.1 18.15,42.24 19.42,43.51 MCP2120.13 19.42,46.6 v18.91,47.11 | 28.71,39.19 28.82,39.19 28.79,39.16 MCP2120.7 | 44.49,80.03 U$17.3
  Top 0.254: U$4.6 U$4.7 42.05,35.96 42.07,35.99 42.05,36.01 U$6.2 40.8,39.58 40.78,39.57 | U$4.6 43.35,35.89 43.45,35.99 | U$4.5 U$4.6 | U$4.5 44.61,35.89 44.67,35.83 | 40.78,39.57 40.7,39.49 | 40.78,39.57 U$6.1 | U$1.VCC2 30.64,48.53 30.64,45.44 | 44.51,35.89 44.51,35.83 | 44.51,35.89 U$4.5 | v46.65,35.99 44.51,35.99 44.51,35.89 | v12.51,71.8 6.87,71.8 arc90 v5.19,70.12 | v18.91,69.51 v18.91,67.84 | 45.03,62.05 U$24.3 | 45.43,74.7 45.43,74.73 U$19.3 44.36,74.7 | 44.21,69.85 U$21.3 | 44.51,65.55 44.51,65.67 U$22.3 | v18.91,77.29 18.3,78.2 v17.39,79.42
  Top 0.305: 45.43,74.7 44.36,74.7 | 45.12,65.4 U$23.3 | 37.5,62.5 37.5,65.1 44.06,65.1 44.51,65.55 45.28,65.55 45.43,65.55 45.43,69.82 45.43,72.41 45.43,74.73 45.43,77.44 v45.43,80.03 44.49,80.03 | 45.03,62.05 44.21,62.05 43.75,62.5 37.5,62.5 | 45.39,72.45 U$20.3 | 45.39,69.85 44.21,69.85 | 37.5,62.5 37.5,59.76 v37.2,59.46 | 45.39,77.47 U$18.3
  Top 0.406: 29.73,76.68 D10.2 29.73,76.64 | 29.73,79.69 D9.2 | 29.73,74.54 D11.2 29.73,74.51 | 29.73,71.19 29.73,71.31 D12.2 | 29.73,69.06 29.73,69.17 D13.2 | 29.73,66.16 29.73,66.28 D14.2 | 29.73,64.18 D15.2 29.73,64.15 | 29.73,61.13 D16.2 | v28.66,44.37 30.64,44.37
  Top 0.61: U$5.14 28.71,39.19 28.71,40.71 v30.64,40.71 30.64,44.37 30.64,45.44 | v26.23,21.2 v32.47,21.2 | 29.73,76.68 29.73,79.69 | 29.73,74.54 29.73,76.64 | 29.73,74.51 29.73,71.31 29.73,69.17 29.73,66.28 29.73,64.18 | 29.73,61.13 29.73,64.15 | U$1.VCC2 30.64,48.51 30.64,45.44 | 31.93,46.35 R2.1 31.93,45.44 30.64,45.44 | C9.2 26.07,10.84 26.17,10.94 SERVO1.2 | v50.15,12.21 C19.2
  Top 0.813: 29.73,61.13 29.73,58.69 29.43,58.39 v29.27,58.39 v24.24,58.39
  Top 1.016: SERVO3.2 17.28,15.46 17.23,15.41 17.23,13.13 16.32,12.21 v1.54,12.21
  Bottom 0.203: 52.74,68.3 v52.74,67.38 52.74,64.94 v49.85,62.05 | 52.74,68.3 C8.1 | v47.1,71.65 49.85,71.65 51.07,72.87 52.74,72.87 52.74,68.3 | v29.27,58.39 v37.5,58.39 | U$13.1 14.64,71.5 16.93,71.5 v18.91,69.51 | 38.87,3.22 R8.2 | 18.61,47.42 v18.91,47.11
  Bottom 0.254: 17.28,21.1 17.28,21.05 17.23,21.05 17.39,21.2 | v26.23,21.2 26.17,21.15 | 23.63,4.08 23.63,3.83 23.87,3.59 IC2.3 | U$9.1 10.82,80.49 0.77,80.49 0.77,75.46 | 0.77,68.3 0.77,70.12 | 0.77,70.12 0.77,75.46 | 10.07,77.44 7.94,77.44 5.96,75.46 0.77,75.46 | 10.07,77.44 11.14,77.44 12.51,78.81 15.65,78.81 U$10.1 16.01,78.35 16.32,78.35 v17.39,79.42 | U$15.1 8.23,68.3 0.77,68.3 | v12.51,71.8 14.43,71.8 U$13.1 14.7,71.65 | 0.77,70.12 v5.19,70.12 | U$14.1 19.17,67.38 v18.91,67.84 17.54,67.84 17.54,68.75 arc90 16.47,69.67 16.01,69.67 arc90 14.8,68.75 14.8,66.16 U$16.1 15.8,64.33 | 20.74,75.55 U$11.1 | U$12.1 10.07,73.88 10.07,77.44 | v1.23,53.51 1.23,61.13 0.77,61.59 0.77,68.3 | v30.64,40.71 37.2,40.71 37.81,41.32 45.58,41.32 46.65,40.25 v46.65,35.99
  Bottom 0.305: 32.47,7.79 32.52,7.79 I2C-1.1 | R7.2 35.83,3.22 | 38.87,13.13 38.42,12.67 R6.2 38.48,11.6 39.18,11.6 39.18,10.54 39.27,10.54 R5.2 39.33,10.49 | 39.33,10.49 39.33,10.54 | 39.33,10.49 39.33,10.38 | v29.73,59.46 v37.2,59.46 | 20.74,75.55 20.65,75.55 v18.91,77.29
  Bottom 0.406: v26.23,21.2 17.23,21.2 17.23,18.31 | 17.23,18.31 17.23,15.57 | C3.+ 12.1,48.59 13.27,47.42 18.61,47.42 22.26,47.42 23.18,46.5 23.18,45.44 24.09,44.52 28.51,44.52 v28.66,44.37 | X7.2 6.72,12.53 6.72,14.19 7.33,14.8 9.31,14.8 12.81,18.31 17.23,18.31
  Bottom 0.457: I2C-2.1 I2C-1.1 | I2C-2.1 32.47,15.57 | I2C-2.1 32.52,17.65 32.47,17.7 32.52,17.7 32.52,21.15 v32.47,21.2
  Bottom 0.61: 17.28,21.05 SERVO3.2 SERVO2.2 17.28,4.08 23.63,4.08 | U$2.3 7.94,56.81 7.94,53.51 7.94,50.77 10.07,48.64 C3.+ 10.07,48.48 7.48,45.89 4.28,45.89 2.35,43.96 X5.1 | 26.17,21.15 SERVO1.2 | 17.39,21.2 v26.23,21.2 | 32.52,17.7 38.87,17.7 38.87,13.13 | 32.47,7.79 32.47,6.42 35.67,3.22 R7.2 35.74,1.94 36.59,1.09 36.89,1.09 | 38.87,3.22 38.87,2 37.96,1.09 36.89,1.09 | I2C.1 44.21,9.01 42.38,7.18 42.38,2.92 40.4,0.93 36.89,0.93 36.89,1.09 | IC3.3 50.9,11.46 v50.15,12.21
  Bottom 0.813: v24.24,58.39 18.15,53.51 7.94,53.51 v1.23,53.51 0.93,53.21 0.93,12.82 v1.54,12.21 | I2C.1 45.88,9.01 46.14,8.76 IC3.3
ADD0
  Bottom 0.254: U$9.2 12.31,79.53 12.97,80.18 35.06,80.18
  Bottom 0.305: JP1.1 36.13,79.12 35.06,80.18
  Bottom 0.406: R14.2 9.61,79.42 U$9.2
ADD1
  Bottom 0.254: R15.2 15.96,77.74 U$10.2 16.93,77.7 19.21,79.57 34.45,79.57
  Bottom 0.305: 34.45,79.57 34.91,79.12 34.91,77.59 35.83,76.68 JP1.3
ADD2
  Bottom 0.254: 34.91,74.8 U$11.2 19.67,74.8 19.67,74.7 R16.2
  Bottom 0.305: JP1.5 36.13,74.09 35.63,74.09 34.91,74.8
ADD3
  Bottom 0.254: 9.61,73.17 9.66,73.17 U$12.2 9.61,73.17 | 21.5,71.6 JP1.7 | R17.2 8.33,73.17 9.61,73.17
  Bottom 0.305: 9.66,73.17 12.66,73.17 13.27,72.56 20.59,72.56 21.5,71.65 21.5,71.6
ADD4
  Bottom 0.203: 14.64,70.73 16.62,70.73 17.84,69.51 arc90 18.76,68.6 18.91,68.6
  Bottom 0.254: 18.91,68.6 19.67,68.6 20.13,69.06 JP1.9 | U$13.2 14.64,70.89 | U$13.2 13.58,70.84 13.58,70.73 R18.2 | U$13.2 14.64,70.73
ADD5
  Bottom 0.254: U$14.2 20.74,66.62 | U$14.2 20.84,66.47 36.13,66.47 JP1.11 | R19.2 19.86,66.62 U$14.2
ADD6  (via drill 0.5)
  Top 0.254: v13.12,65.55 14.19,64.49 v19.82,64.49
  Bottom 0.254: 8.39,67.38 10.53,67.38 12.36,65.55 v13.12,65.55 | U$15.2 8.39,67.33 8.39,67.38 | R20.2 7.33,67.33 7.33,67.38 8.39,67.38 | JP1.13 36.13,64.03 34.61,64.03 34.45,64.18 20.43,64.18 v19.82,64.49
ADD7
  Bottom 0.254: R21.2 14.59,63.67 14.64,63.72 14.69,63.68 U$16.2 28.86,63.68 31.1,61.44 JP1.15
ADG0
  Top 0.254: JP1.2 38.57,79.12 41.12,79.12 R22.2
ADG1
  Top 0.254: 38.57,76.68 JP1.4 41.17,76.68 R23.2
ADG2
  Top 0.254: 38.62,74.09 38.57,74.09 | JP1.6 38.62,74.09 | R24.2 40.97,74.09 38.62,74.09
ADG3
  Top 0.254: JP1.8 38.72,71.65 41.12,71.65 R25.2
ADG4
  Top 0.254: R26.2 40.97,69.06 JP1.10
ADG5
  Top 0.254: JP1.12 38.72,66.47 41.12,66.47 R27.2
ADG6
  Top 0.254: JP1.14 38.72,63.93 38.72,63.88 40.97,63.88 R28.2
ADG7
  Top 0.254: R29.2 41.28,61.44 JP1.16
AGND
  Top 0.152: 55.33,63.64 55.33,63.57 | 55.27,63.64 55.33,63.64 | DEPTH.1 55.33,70.78 55.33,63.64
  Top 0.203: 54.72,59.15 54.72,60.92 | C6.2 55.27,63.64 55.33,63.72 | C6.2 53.66,63.72 | C7.2 C6.2 | U$3.11 49.85,66.34 | C6.2 51.07,63.64 51.07,66.34 U$3.9 | C5.- 52.59,56.41
  pour Top: 49.54,72.87 49.54,57.93 51.37,56.87 51.37,54.73 56.4,54.73 56.4,72.87
GND  (via drill 0.3, 0.3 pad 0.46, 0.5, 0.7 pad 1.27)
  Top 0.152: MCP2120.4 v21.96,41.02
  Top 0.203: U$7.3 48.12,71.24 v48.63,70.73 49.12,70.24 U$7.10 49.12,68.79 49.09,68.75 48.96,68.88 U$7.9 | MCP2120.14 18.15,45.74 16.78,47.11 16.78,49.7 15.35,51.13 | 15.35,51.13 15.25,51.23 | 15.35,51.13 U$1.GND3 | R13.2 R12.2 | U$3.1 47.87,60.5 47.87,66.34 U$3.14 47.85,66.45 47.87,66.47 47.87,66.77 | 14.64,59.46 14.8,59.46 | 26.07,9.16 C9.1 26.07,9.32
  Top 0.254: 44.36,39.64 v45.73,39.64 | 44.36,39.64 44.36,39.8 44.59,39.8 U$6.4 | U$6.3 43.32,39.64 44.36,39.64 | v28.36,7.64 28.02,7.98 | 14.8,57.93 14.64,57.93 | 14.8,58.08 14.8,57.93 | v15.25,61.74 15.25,57.93 14.8,57.93 | v11.9,68.91 11.75,68.75 | U$19.1 44.36,73.17 43.75,73.17 v43.6,73.02 | 44.36,68.3 44.31,68.3 U$21.1 43.96,68.35 v43.45,67.84 44.11,67.17 U$22.1 | U$20.1 44.09,70.58 v43.6,70.58 | U$23.1 44.57,63.48 v44.21,63.11 | U$24.1 45.12,60.53 45.12,60.52 v44.21,60.52 | 8.55,64.64 8.55,62.81 | 8.95,75.51 C12.- | 13.73,74.24 14.03,74.54 | U$17.1 44.27,78.57 v43.6,77.9 | U$18.1 44.11,75.97 v43.6,75.46
  Top 0.305: 26.99,7.95 | C9.1 arc90 26.29,8.86 | 47.87,60.5 47.87,57.02 v47.41,56.56
  Top 0.406: 23.94,76.53 23.94,76.64 D2.1 | 23.94,79.69 D1.1 | 23.94,74.39 23.94,74.51 D3.1 | 23.94,71.38 D4.1 23.94,71.31 | 23.94,69.21 D5.1 23.94,69.17 | 23.94,66.28 D6.1 | 23.94,64.06 D7.1 23.94,63.99 | 23.94,61.13 D8.1 | U$8.4 28.36,7.98 v28.36,7.64 | U$5.7 36.33,28.72 v35.98,28.37 | U$5.3 30.06,30.22 30.04,30.2 30.01,30.22 U$5.2 29.91,30.22 29.88,30.2 29.86,30.22 U$5.1 28.03,30.22 v27.6,30.65 | 13.88,74.54 C13.- | 14.03,74.54 13.88,74.54 | 13.88,74.54 13.88,74.24 | R13.2 8.76,14.59 v9.46,13.89
  Top 0.61: 23.94,79.69 23.94,76.64 23.94,74.51 23.94,71.38 | 23.94,69.21 23.94,71.31 | 23.94,69.17 23.94,66.28 23.94,64.06 | 23.94,61.13 23.94,63.99 | 26.07,9.32 26.23,9.47 26.99,8.71 26.99,7.95 26.99,7.79 27.02,7.83 U$8.4 | U$27.4 50.55,27.45 v47.26,27.45 | R3.1 19.37,2.61 18.91,3.07 C10.- | 35.06,6.12 34.15,5.2 31.41,5.2 | R4.1 31.41,2.31 31.41,5.2 | v30.19,5.81 30.8,5.81 31.41,5.2 | C3.- 10.07,51.07 5.85,51.07 POWER.1
  Top 0.813: C16.- 12.97,68.3 v11.9,68.91 | C18.- 8.55,64.64 8.55,59.71 | 23.94,61.13 20.28,61.13 18.3,59.46 14.8,59.46 14.8,58.08 | 13.73,74.24 10.53,74.24 8.95,75.51 | 9,59.46 14.64,59.46 | C17.- 8.55,59.71 | 8.55,59.71 8.55,59.3 | 2.6,65.7 2.6,71.9 C14.- 2.15,72.36 | 2.15,72.36 2.15,72.26 | C11.- 2.15,77.03 2.15,72.36 | R31.1 50.46,20.9 C20.- 50.46,15.65 C19.1
  Bottom 0.152: IC1.3 20.75,32.79 21.2,33.24 IC1.EXP 21.15,33.35 21.2,33.4 | IC1.3 21.65,32.79 23.94,30.5 | IC1.3 19.82,32.79 20.59,32.02 | IC1.M 19.04,31.24 | 20.59,32.02 19.82,32.02 | 20.59,32.02 22.26,32.02 22.57,31.72
  Bottom 0.203: v48.63,70.73 49.76,69.51 | v44.21,60.52 44.21,60.37 | 47.41,52.75 v47.41,56.56 | 52.74,58.08 52.74,56.56 52.59,56.41
  Bottom 0.254: U$15.3 8.55,66.48 8.55,64.49 | U$16.3 15.71,62.2 v15.25,61.74 | U$13.3 14.64,69.51 12.51,69.51 v11.9,68.91 11.9,68.75 6.26,68.75 6.26,71.5 8.78,71.5 | v44.21,63.11 44.36,63.27 44.36,60.52 v44.21,60.52 | U$12.3 9.61,72.41
  Bottom 0.305: U$1.GND4 15.38,28.98 | 5.8,49.55 5.85,49.55 POWER.1
  Bottom 0.813: C3.- 10.12,51.07
  pour Bottom: 57.92,0.33 57.92,81.1 0.17,81.1 0.17,0.33
N$1
  Bottom 0.203: UART.1 12.66,44.32 13.12,44.83 22.57,44.83 23.63,43.76 25.31,43.76 26.07,43 26.07,31.41 23.18,28.52 21.35,28.52 20.65,29.22 IC1.26
N$2  (via drill 0.3, 0.5)
  Top 0.203: v12.36,31.87 12.36,34.31 13.12,35.07 v13.12,41.78 | v18,28.98 21.65,28.98 v22.57,29.89
  Bottom 0.203: 17.08,31.11 17.08,30.04 | 17.08,31.11 16.17,32.02 12.36,32.02 v12.36,31.87 | v13.12,41.78 UART.2 | 17.08,31.11 17.08,29.89 v18,28.98 | v22.57,29.89 21.65,29.89 21.15,30.4 IC1.25
N$3
  Top 0.203: X4.4 9.82,23.34
  Top 0.305: R13.1 11.9,19.44 11.9,22.42 11.14,23.19 9.77,23.19 9.77,23.21 X4.4
N$4  (via drill 0.3)
  Top 0.152: X4.2 12.04,24.85 13.73,26.54 13.73,29.59 14.34,30.2 14.34,31.41 14.95,32.02
  Top 0.203: v17.08,32.94 16.17,32.02 14.95,32.02
  Bottom 0.203: IC1.5 18.24,33.79 17.69,33.24 17.39,33.24 v17.08,32.94
N$5  (via drill 0.3)
  Top 0.152: X4.1 9.75,25.62 10.07,25.62 v11.44,27 11.59,27 13.27,28.67 13.27,29.74 14.03,30.5 14.03,31.72 14.19,31.87 14.19,34.31 v14.49,34.62
  Top 0.254: X4.1 10.1,25.65
  Bottom 0.152: 11.14,25.78 11.44,26.08 v11.44,27 | 18.91,35.07 18.91,35.22 | v14.49,34.62 14.19,34.77 13.88,35.53 13.88,36.29 14.64,37.05 18.15,37.05 18.61,36.6 18.61,35.83 19.14,35.3
  Bottom 0.203: IC1.8 19.43,35.59 19.14,35.3 18.91,35.07 18.85,35.01 IC1.7
  Bottom 0.254: v11.45,27 11.45,26.23 11.44,26.23 11.14,25.78 11.14,19.83 10.53,19.22 5.6,19.22 C1.-
N$6
  Bottom 0.305: 17.23,34.29 17.23,34.32 C2.2 | 17.23,34.29 IC1.6 | 17.23,34.29 17.23,34.16
N$7  (via drill 0.3, 0.5)
  Top 0.203: 33.63,43.76 R2.2 33.63,43.91 33.69,43.91 | 46.97,54.12 46.97,54.14 | 31.33,36.37 31.41,36.44 | 31.33,36.37 U$5.12 | 31.33,36.37 31.25,36.29 31.25,33.09 31.86,32.18 31.86,24.56 32.02,24.4 v36.59,24.4
  Top 0.254: 33.63,43.76 v35.37,43.76 37.05,45.44 37.05,52.14 39.03,54.12 46.97,54.12 47.1,54.12 48.5,55.51 U$3.2
  Top 0.305: U$1.PD0 45.88,23.13 45.88,16.63 I2C.4 | U$5.12 31.25,39.64 v35.37,43.76
  Bottom 0.203: U$1.PD0 45.86,23.97 45.43,24.4 v36.59,24.4
N$8  (via drill 0.5)
  Top 0.203: U$3.13 48.48,66.31 48.48,63.27 48.63,63.11 v48.63,62.66
  Bottom 0.203: C5.+ 50.1,57.68 48.63,59.3 v48.63,62.66
N$9
  Top 0.203: C7.1 52.59,60.28 52.59,61.74 51.52,61.74 49.24,64.03 49.24,66.34 U$3.12
N$10  (via drill 0.5)
  Top 0.457: U$8.3 27.62,5.38 v29.88,7.64
  Bottom 0.305: 29.88,9.47 29.73,9.47
  Bottom 0.457: 29.73,9.47 R9.1 | v29.88,7.64 29.88,9.32 | 29.88,9.32 29.88,9.47 | R30.1 30.1,9.53 29.88,9.32
N$11
  Top 0.254: DEPTH.2 51.57,70.78 50.45,69.66 U$3.10
N$12  (via drill 0.5)
  Top 0.203: R1.2 33.63,46.5 35.98,46.5 v36.13,46.65 | v51.52,58.85 50,58.85 49.15,59.7 U$3.3
  Top 0.254: 30.04,36.75 29.98,36.75 U$5.13
  Top 0.305: v30.04,38.27 30.04,36.75 | v38.26,40.1 v38.26,46.65 | U$1.PD1 45.88,25.67 45.88,25.78 44.67,24.4 44.67,19.22 43.14,17.7 43.14,15.26 44.36,14.04 45.78,14.04 I2C.3
  Bottom 0.203: v38.26,46.65 v36.13,46.65
  Bottom 0.254: U$1.PD1 45.86,28.06 38.87,28.06 38.87,38.88 v38.26,40.1
  Bottom 0.305: v38.26,40.1 31.86,40.1 v30.04,38.27 | v38.26,46.65 51.37,46.65 52.29,47.57 52.29,54.12 51.52,54.73 v51.52,58.85
N$15  (via drill 0.5)
  Top 0.406: R4.2 33.02,1.48 32.78,1.24 28.97,1.24 v28.66,1.54
  Bottom 0.254: IC2.1 28.71,3.47 28.71,1.54
  Bottom 0.305: 28.66,3.07 28.47,3.26 IC2.1
  Bottom 0.406: 28.66,3.07 v28.66,1.54
N$16
  Bottom 0.457: R30.2 30.85,20.85 30.8,20.9 33.08,23.19 U$1.PB5
N$17
  Top 0.152: U$1.PG0 54.52,51.13 56.86,48.79 56.86,10.23 51.93,5.3 SV1.1
N$18  (via drill 0.5)
  Top 0.203: 37.05,19.83 v38.11,19.83 | v44.82,52.6 44.67,51.68 44.67,44.67 U$6.5 | 37.05,23.64 arc90 37.5,24.25 37.5,24.4 arc90 37.05,25.01 | U$7.7 47.62,68.05 46.65,67.08 46.65,60.52 45.88,59.76 45.88,56.56 v44.82,55.49
  Top 0.254: I2C-2.3 37.05,15.51 37.05,19.83 37.05,23.64 | 37.05,25.01 37.05,26.69 36.59,27.15 34.61,27.15 33.85,27.91 33.85,30.22 U$5.5
  Top 0.305: U$6.5 46.83,42.39 v48.48,40.71 | U$4.1 40.82,30.65 40.86,30.65 40.86,33.85 v41.01,34.01
  Bottom 0.203: v44.82,52.6 v44.82,55.49
  Bottom 0.305: 48.48,34.01 v48.48,40.71 | 48.48,34.01 v41.01,34.01 | v38.11,19.83 48.63,19.83 49.69,20.9 49.69,32.18 48.48,34.01 | 37.6,15.57 37.66,15.57 | 37.6,15.57 I2C-2.3 | R5.1 37.57,15.57 37.6,15.57
N$19  (via drill 0.3, 0.5)
  Top 0.203: v46.65,59.15 arc90 47.1,59.61 47.1,66.77 48.12,67.79 U$7.8
  Top 0.254: I2C-2.4 40.14,18.56 42.05,21.31 U$4.2
  Top 0.305: 34.91,30.37 U$5.6 35.06,32.63 v39.79,32.63 v39.79,43.61 | 43.29,44.81 U$6.6 43.29,44.78 43.29,44.81 | v43.29,42.84 43.29,44.81 | v42.07,53.36 42.07,46.96 43.29,45.44 43.29,44.81 | U$4.2 42.05,30.65 42.07,30.65 v42.07,32.63
  Bottom 0.203: v46.65,59.15 46.65,58.54 42.07,53.97 v42.07,53.36
  Bottom 0.305: v42.07,32.63 v39.79,32.63 | 40.18,15.41 40.14,15.41 I2C-2.4 | R6.1 40.18,15.41 | 40.18,15.41 40.25,15.41 | v43.29,42.84 40.55,42.84 v39.79,43.61
N$20
  Top 0.254: R12.1 5.5,18
  Top 0.305: 5.5,18 5.5,18.16 6.57,19.22 10.38,19.22 11.29,20.14 11.29,21.2 10.05,22.45 X4.5
N$21  (via drill 0.5)
  Top 0.254: I2C-1.3 37.6,9.52 36.44,10.69 36.44,20.44 36.13,20.75 v34.15,20.75 | U$5.9 35.06,37.97 v35.67,38.58
  Bottom 0.254: v35.67,38.58 36.74,38.58 37.2,38.12 37.2,37.66 37.2,27.6 34.45,27.6 34.45,20.75 34.3,20.9 v34.15,20.75
  Bottom 0.305: 37.6,7.95 37.66,7.95 | 37.6,7.95 I2C-1.3 | R7.1 37.44,7.95 37.6,7.95
N$22  (via drill 0.5)
  Top 0.254: I2C-1.4 40.14,10.94 39.03,12.06 39.03,21.51 39.48,21.97 39.48,26.54 v38.11,27.3 | v38.11,38.43 37.5,39.49 35.06,39.49 33.85,38.27 33.85,36.6 33.79,36.55 U$5.10
  Bottom 0.254: v38.11,27.3 v38.11,38.43
  Bottom 0.305: 40.14,7.95 40.09,7.95 | 40.14,7.95 I2C-1.4 | R8.1 40.64,7.95 40.14,7.95
N$23
  Top 0.61: 3.37,49.65 3.37,49.55 | POWER.2 3.37,49.65 | U$2.1 3.37,56.81 3.37,49.65
  Bottom 0.61: C4.+ 13.17,55.6 9,59.76 3.82,59.76 U$2.1
N$24
  Top 0.203: 49.12,73.36 U$7.1 49.12,73.44 49.09,73.48 50.46,74.85 52.74,74.85 54.22,76.32 X1.4
N$25
  Top 0.203: X1.3 51.68,77.29 48.62,74.23 U$7.2
N$26
  Top 0.203: X1.2 49.24,77.44 47.62,75.82 U$7.4
N$27
  Top 0.203: U$7.5 47.12,73.16 46.6,73.68 X1.1
N$28  (via drill 0.3 pad 0.46)
  Top 0.305: v21.81,19.83 v21.81,27
  Bottom 0.305: R9.2 28.97,12.36 28.05,13.43 22.87,13.43 21.81,14.65 v21.81,19.83 21.81,19.98 | U$1.PE2 17.92,27 v21.81,27
N$29  (via drill 0.5)
  Top 0.203: X2.2 11.14,34.46 12.19,35.52 12.2,35.52 12.2,40.1 11.75,40.41 11.75,42.08 11.59,42.39 v11.59,43.15
  Bottom 0.203: U$1.D- 11.95,43.51 v11.59,43.15
N$30  (via drill 0.5)
  Top 0.254: U$8.6 25.16,7.95 25.19,7.98 | 25.14,5.38 25.16,5.35 | 25.14,5.38 U$8.1 25.03,5.38 25.01,5.35 | 25.14,5.38 25.12,5.39
  Top 0.457: 25.19,7.98 U$8.5 | 25.12,5.39 U$8.6 | U$8.2 U$8.1 23.92,5.38 23.48,5.81 v23.48,7.03 | v13.42,7.03 v18.45,7.03
  Bottom 0.254: LASER.2 5.04,5.81
  Bottom 0.457: v18.45,7.03 v23.48,7.03 | v13.42,7.03 9.31,7.03 8.09,5.81 5.04,5.81
N$31
  Top 0.203: X2.3 11.09,33.65 12.66,35.22 12.66,40.41 12.36,40.56 12.36,43 15.4,46.05 U$1.D+
N$32  (via drill 0.5)
  Top 0.203: X2.1 11.16,35.25 11.75,35.83 11.75,39.19 v11.44,39.49
  Bottom 0.203: v11.44,39.49 13.58,41.02 15.4,41.02 15.4,40.91 | 15.4,40.91 15.4,40.86 | 15.4,40.91 U$1.VBUS
N$33  (via drill 0.3)
  Top 0.152: v17.69,31.87 17.69,30.96 16.32,29.59
  Top 0.203: X4.3 12.31,24.05 14.19,25.93 14.19,28.98 14.8,29.59 16.32,29.59
  Bottom 0.152: IC1.4 18.35,33.29 18.15,33.09 18.15,32.33 v17.69,31.87
N$34
  Top 0.305: U$1.PE3 20.43,23.19 19.82,22.58 SERVO3.3
N$35  (via drill 0.5)
  Top 0.305: X2.5 9.55,32.02 10.07,32.02 v11.75,30.35
  Bottom 0.305: R10.1 4.22,32.09 7.48,28.82 10.22,28.82 v11.75,30.35
N$36  (via drill 0.5)
  Top 0.305: 9.49,32.94 X2.4 | 9.49,32.94 9.46,32.94 | v11.59,32.94 9.49,32.94
  Bottom 0.305: v11.59,32.94 11.59,37.21 10.22,38.58 7.63,38.58 6.26,37.21 6.26,36.6 4.58,34.92 R11.1
N$37
  Top 0.305: U$1.PE4 20.46,25.65 19.21,24.4 19.21,18.16 18.61,17.55 18.61,10.38 SERVO2.3
N$38
  Top 0.203: U$1.PE5 23,22.45 28.66,16.78 28.66,15.57 SERVO1.3
N$39
  Top 0.152: U$1.PG1 56.4,45.66 56.4,11.3 50.91,5.81 50.91,3.98 51.93,2.66 | 51.93,2.66 51.98,2.61 | 51.93,2.66 SV1.2
N$40
  Top 0.152: 49.39,5.2 SV1.3 49.39,6.12 55.79,12.52 55.79,42.84 51.07,47.57 51.07,48.46 U$1.PC1
N$41
  Top 0.152: U$1.PC0 51.17,51.13 52.29,50.01 52.29,47.26 56.1,43.45 56.1,12.06 50.46,6.42 50.46,3.83 49.39,2.76 SV1.4
N$42
  Top 0.152: SV1.5 46.9,5.25 46.95,5.2 55.18,13.43 55.18,42.24 50.76,46.65 50.15,46.65 48.32,48.48 48.4,48.56 U$1.PC3
N$43
  Top 0.152: 46.85,2.66 46.8,2.61 | SV1.6 46.85,2.66 | 46.85,2.66 48.32,4.14 48.32,5.66 55.49,12.82 55.49,42.54 50.76,47.26 50.46,47.26 49.69,48.03 49.69,49.86 48.42,51.13 U$1.PC2
N$44
  Top 0.254: 44.51,79.27 | 44.51,79.27 U$17.2 | R22.1 42.98,79.27 44.51,79.27
N$45
  Top 0.254: U$18.2 44.36,76.68 42.98,76.68 R23.1
N$46
  Top 0.254: U$19.2 44.36,74.09 43.18,74.09 R24.1
N$47
  Top 0.254: U$20.2 44.41,71.65 43.03,71.65 R25.1
N$48
  Top 0.254: U$21.2 44.21,69.06 43.18,69.06 R26.1
N$49
  Top 0.254: U$22.2 44.51,66.47 43.03,66.47 R27.1
N$50
  Top 0.254: U$23.2 44.97,64.22 44.97,64.18 42.98,64.18 R28.1
N$51
  Top 0.254: U$24.2 45.02,61.29 43.33,61.29 R29.1
N$52
  Top 0.152: SV1.7 44.36,5.2 45.88,6.73 47.41,6.73 54.57,13.89 54.57,40.86 48.78,46.65 47.71,46.65 45.86,48.51 U$1.PC5
N$53
  Top 0.152: 44.21,2.61 SV1.8 45.43,3.83 45.43,5.35 46.34,6.27 47.56,6.27 54.88,13.58 54.88,41.17 48.93,47.11 47.87,47.11 47.26,47.72 47.26,49.86 45.88,51.23 45.86,51.2 U$1.PC4
N$54
  Top 0.61: R33.1 48.35,30.84 U$27.3
N$55  (via drill 0.7)
  Top 0.61: X3.2 49.69,38.1 v49.69,42.54
  Top 0.813: R31.2 52.74,20.9 52.74,19.02 C20.+
  Bottom 0.61: v49.69,42.54 50.3,41.93 54.57,41.93 55.18,41.32 55.18,22.27 53.05,20.14 53.05,19.07 C20.+ | IC3.4 53.1,15.06 53.05,15.11 55.46,17.52 C22.1
  Bottom 0.813: C20.+ 53.05,19.02 53.05,15.11 53.05,15.06 IC3.4
N$56
  Bottom 0.61: R32.2 55.49,6.12 55.5,6.13 55.5,8.72
  Bottom 0.813: 55.49,8.71 55.5,8.72 IC3.1
N$57
  Top 0.61: U$27.6 53.33,28.24 | 53.33,28.24 U$27.5 U$27.2 52.29,30.96 | 53.33,28.24 53.35,28.21 | U$27.1 52.41,30.84 52.29,30.96 | 52.29,30.96 52.29,31.72 52.13,31.87 50.15,31.87 48.93,33.09 48.93,35.83 49.09,35.99 48.97,36.1 X3.1
N$61
  Top 0.305: U$25.1 24.03,36.35 22.72,37.66 20.89,37.66 20.59,37.97 20.59,38.88 20.74,39.03 20.69,39.09 MCP2120.3
N$62
  Top 0.305: U$25.3 19.52,33.55 18.61,34.46 18.61,37.21 19.37,37.97 19.37,39.03 19.42,39.09 MCP2120.2
PA0  (via drill 0.3 pad 0.46, 0.5)
  Top 0.254: D1.2 25.77,79.69 v25.77,78.35 | 5.96,78.2 C11.+ | v33.85,53.06 33.85,54.88 34,55.04 34,76.37 33.85,76.53 v33.85,78.81
  Top 0.305: 5.96,78.2 7.94,80.18 20.74,80.18 v22.57,78.35
  Top 0.61: D1.2 D9.1
  Bottom 0.203: U$1.PA0 30.62,52.57 31.1,53.06 v33.85,53.06
  Bottom 0.254: v22.57,78.35 v25.77,78.35 26.23,78.81 v33.85,78.81
  Bottom 0.305: C11.+ 5.96,78.2 7.33,79.57 R14.1
PA1  (via drill 0.3 pad 0.46, 0.5)
  Top 0.254: D2.2 27.18,78.05 v27.9,78.05 | v21.5,77.74 20.28,76.53 12.97,76.53 12.05,75.61 C12.+ | D10.1 28.51,77.32 | v33.08,78.05 33.39,77.74 33.39,75.76 33.54,75.61 33.54,56.71 31.71,54.58 31.71,50.01 33.18,48.53 | 33.18,48.53 33.24,48.48 | U$1.PA1 33.18,48.53
  Top 0.406: D10.1 27.9,76.68
  Top 0.61: D2.2 D10.1
  Bottom 0.152: v27.9,78.05 27.6,77.74 v21.5,77.74
  Bottom 0.254: v33.08,78.05 v27.9,78.05
  Bottom 0.305: C12.+ 11.44,75.61 11.44,76.07 13.12,77.74
  Bottom 0.406: 13.12,77.74 R15.1
PA2  (via drill 0.3, 0.3 pad 0.46, 0.5)
  Top 0.254: D3.2 26.07,74.54 v26.07,73.17 | v32.63,73.32 32.93,73.02 32.93,72.41 33.08,72.26 33.08,57.02 v30.64,54.27
  Top 0.305: C13.+ 17.74,73.32 v22.72,73.32
  Top 0.406: D11.1 27.9,74.54
  Top 0.61: D3.2 D11.1
  Bottom 0.152: v32.63,73.32 26.23,73.32
  Bottom 0.203: v30.64,54.27 29.27,52.9 29.27,50.46 29.73,50.01 32.04,50.01 U$1.PA2
  Bottom 0.254: v22.72,73.32 22.72,73.17 v26.07,73.17 26.23,73.32
  Bottom 0.406: R16.1 17.84,74.7 C13.+
PA3  (via drill 0.3, 0.3 pad 0.46, 0.5)
  Top 0.254: 4.58,72.41 C14.+ 4.74,72.41 | 4.74,72.41 4.74,72.26 | v21.81,72.56 4.74,72.56 4.74,72.41 | v27.9,72.72 27.9,71.34 | v31.86,72.56 arc-90 32.47,71.95 32.47,70.89 32.63,70.73 32.63,57.48 v30.64,55.34
  Top 0.406: 27.9,71.34 D12.1 D4.2
  Top 0.61: 27.9,71.34 D4.2
  Bottom 0.203: v30.64,55.34 33.08,55.34 34.61,53.82 34.61,49.68 U$1.PA3
  Bottom 0.254: v21.81,72.56 21.96,72.41 27.6,72.41 v27.9,72.72 28.21,72.41 31.71,72.41 v31.86,72.56
  Bottom 0.305: C14.+ 4.74,72.41 5.8,73.48 6.26,73.48
  Bottom 0.406: 6.26,73.48 R17.1
PA4  (via drill 0.3, 0.3 pad 0.46)
  Top 0.254: C15.+ 10.22,70.33 10.22,70.28 20.43,70.28 v22.72,67.84 | v25.77,67.84 26.38,69.21 | v31.71,68.14 32.02,67.38 32.02,66.47 32.17,66.31 32.17,58.24 v30.64,56.41
  Top 0.406: D13.1 27.9,69.21 | 26.38,69.21 D5.2
  Top 0.61: 26.38,69.21 D13.1
  Bottom 0.152: v22.72,67.84 v25.77,67.84 26.68,67.84 26.83,68.14 v31.71,68.14
  Bottom 0.203: v30.64,56.41 33.24,56.41 35.67,53.97 35.67,51.07 35.7,51.1 U$1.PA4
  Bottom 0.254: 35.67,51.07 U$1.PA4
  Bottom 0.305: C15.+ 10.07,70.43 10.38,70.73 11.75,70.73
  Bottom 0.406: 11.75,70.73 R18.1
PA5  (via drill 0.3, 0.3 pad 0.46, 0.3 pad 0.61)
  Top 0.254: C16.+ 16.17,68.3 17.69,66.77 21.35,66.77 v21.81,67.23 | v28.82,67.53 27.9,66.31 | v30.95,67.38 31.56,66.47 31.56,65.86 31.71,65.7 31.71,59 31.1,57.93 v30.64,57.48
  Top 0.406: D6.2 D14.1
  Top 0.61: 27.9,66.31 D6.2
  Bottom 0.152: v21.81,67.23 26.68,67.23 26.99,67.53 v28.82,67.53 29.27,67.53 29.43,67.38 v30.95,67.38
  Bottom 0.203: v30.64,57.48 33.39,57.48 37.05,53.82 37.05,49.7 38.24,48.51 | 38.24,48.51 38.26,48.48 | 38.24,48.51 U$1.PA5
  Bottom 0.305: 17.94,66.37 18,66.31 | R19.1 17.94,66.37 | C16.+ 16.07,68.24 17.94,66.37
PA6  (via drill 0.3 pad 0.46, 0.5)
  Top 0.203: v39.48,45.44 39.48,49.86 U$1.PA6 38.11,51.07
  Top 0.254: D7.2 26.68,63.15 v26.83,62.81
  Top 0.305: v10.07,61.13 10.53,60.68 v13.88,60.68
  Top 0.406: 27.75,64.03 27.75,64.06 D15.1
  Top 0.61: D7.2 27.75,64.03
  Bottom 0.254: v13.88,60.68 16.62,60.68 18.76,62.81 v26.83,62.81 26.83,56.41 24.24,53.82 24.24,45.44 v39.48,45.44 | U$1.PA6 38.26,51.1
  Bottom 0.305: 5.5,67.23 5.19,66.92 5.19,65.7 C17.+ 5.09,64.43 8.39,61.13 v10.07,61.13
  Bottom 0.406: 5.5,67.23 R20.1
PA7  (via drill 0.3)
  Top 0.254: D8.2 26.07,60.86 v26.07,59.46 | D16.1 27.87,59.64 v27.9,59.61
  Top 0.406: D8.2 D16.1
  Bottom 0.254: 12.97,63.57 arc-90 12.88,63.66 R21.1 12.83,63.72 12.81,63.72 12.81,59.46 v26.07,59.46 | U$1.PA7 39.97,47.42 26.68,47.42 26.68,55.19 27.9,56.41 v27.9,59.61
  Bottom 0.406: R21.1 12.81,63.57 C18.+
PF0
  Top 0.203: 17.92,51.15 17.84,51.23 | 17.92,51.15 U$1.PF0 | 17.92,51.15 19.21,49.86 19.21,48.18 20.74,46.65 22.57,46.65 23.23,45.99 MCP2120.10
PF1
  Top 0.152: 24.4,45.44 MCP2120.9
  Top 0.203: 24.4,45.44 24.4,46.65 23.94,47.11 21.81,47.11 20.43,48.48 20.46,48.51 U$1.PF1
PF2
  Top 0.203: MCP2120.8 25.77,46.5 24.4,47.87 24.4,49.25 23.79,49.86 21.65,49.86 20.43,51.07 20.46,51.1 U$1.PF2
RXIR  (via drill 0.3)
  Top 0.152: v12.66,29.43 12.66,31.26 13.12,31.72 13.12,33.85 13.58,34.31 13.58,38.73 14.34,39.49 16.01,39.49 v16.62,40.1 | v21.96,42.84 MCP2120.11
  Bottom 0.152: 12.66,20.59 v12.66,29.43 | v21.96,42.84 20.74,42.84 20.28,42.39 18,42.39 16.62,41.02 v16.62,40.1
  Bottom 0.203: X7.4 4.13,13.59 7.02,16.48 8.55,16.48 12.66,20.59
TXIR  (via drill 0.3)
  Top 0.152: v13.42,31.11 13.42,33.4 13.88,33.85 13.88,36.29 14.64,37.05 16.01,37.05 17.23,38.27 17.23,42.39 v18.15,43.3 | 20.59,45.28 20.66,45.28 MCP2120.12 | 48.17,29.13 48.21,29.09 R33.2
  Top 0.305: v20.13,43.3 20.59,43.76 | 20.59,43.76 20.59,45.28 | 20.59,43.76 21.04,43.3 21.04,42.69 21.96,41.78 22.42,41.78 23.18,42.54 28.36,42.54 29.12,41.78 v29.73,41.78 | v47.41,34.92 47.41,29.28 47.56,29.13 48.17,29.13
  Bottom 0.152: 13.42,20.14 v13.42,31.11 | v18.15,43.3 v20.13,43.3
  Bottom 0.203: X7.3 5.38,13.77 7.18,15.57 8.85,15.57 13.42,20.14
  Bottom 0.305: v29.73,41.78 37.05,41.78 37.35,42.08 45.88,42.08 47.41,40.56 v47.41,34.92
UART0  (via drill 0.3)
  Top 0.152: U$1.PE0 15.38,26.36 v17.08,28.06 | 23.18,39.21 MCP2120.5
  Top 0.203: 23.18,39.21 23.18,40.86 24.24,41.93 26.99,41.93 v27.6,41.32
  Bottom 0.152: v17.08,28.06 24.24,28.06 26.99,30.81 26.99,30.96 27.6,31.57 v27.6,41.32
UART1  (via drill 0.3)
  Top 0.203: 24.5,38.63 MCP2120.6 24.5,39.09 24.55,39.03 24.55,40.25 24.85,40.56 v26.83,40.56 | U$1.PE1 17.84,23.19 16.62,24.4 16.62,26.69 17.54,27.6 24.7,27.6 26.07,28.98 26.07,31.11 v26.83,31.87
  Bottom 0.203: v26.83,31.87 v26.83,40.56